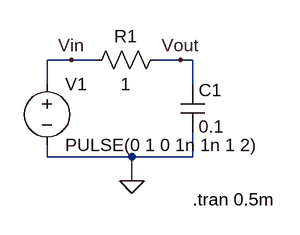
[diagram p0: schematic RC CKT.asc]
RC CKT.asc, the LTspice schematic file:
Version 4.1
SHEET 1 880 680
WIRE 112 96 80 96
WIRE 144 96 112 96
WIRE 256 96 224 96
WIRE 272 96 256 96
WIRE 80 128 80 96
WIRE 272 128 272 96
WIRE 80 224 80 208
WIRE 192 224 80 224
WIRE 272 224 272 192
WIRE 272 224 192 224
WIRE 192 256 192 224
FLAG 192 256 0
FLAG 112 96 Vin
FLAG 256 96 Vout
SYMBOL res 240 80 R90
WINDOW 0 0 56 VBottom 2
WINDOW 3 32 56 VTop 2
SYMATTR InstName R1
SYMATTR Value 1
SYMBOL cap 256 128 R0
SYMATTR InstName C1
SYMATTR Value 0.1
SYMBOL voltage 80 112 R0
WINDOW 123 0 0 Left 0
WINDOW 39 0 0 Left 0
SYMATTR InstName V1
SYMATTR Value PULSE(0 1 0 1n 1n 1 2)
TEXT 272 280 Left 2 !.tran 0.5m

The netlist it stands for:
* RC CKT.asc
R1 Vout Vin 1
C1 Vout 0 0.1
V1 Vin 0 PULSE(0 1 0 1n 1n 1 2)
.tran 0.5m
.backanno
.end